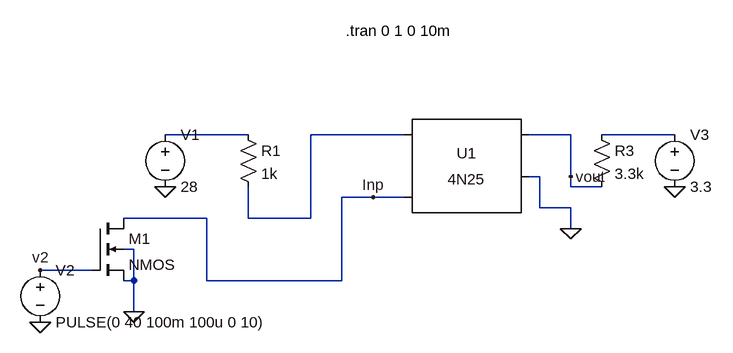
[diagram p0: schematic Optocoupler.asc]
Optocoupler.asc, the LTspice schematic file:
Version 4
SHEET 1 880 680
WIRE -128 112 -256 112
WIRE 112 112 -32 112
WIRE 368 112 304 112
WIRE 528 112 416 112
WIRE 320 176 304 176
WIRE 368 176 368 112
WIRE 368 192 368 176
WIRE 416 192 368 192
WIRE 64 208 16 208
WIRE 112 208 64 208
WIRE 320 224 320 176
WIRE 368 224 320 224
WIRE -192 240 -320 240
WIRE -128 240 -128 192
WIRE -32 240 -32 112
WIRE -32 240 -128 240
WIRE 368 256 368 224
WIRE -304 288 -320 288
WIRE -368 320 -448 320
WIRE -304 336 -304 288
WIRE -304 336 -320 336
WIRE -192 336 -192 240
WIRE 16 336 16 208
WIRE 16 336 -192 336
WIRE -304 384 -304 336
FLAG 368 256 0
FLAG -304 384 0
FLAG -448 400 0
FLAG -256 192 0
FLAG 528 192 0
FLAG 368 176 vout
FLAG 64 208 Inp
FLAG -448 320 v2
SYMBOL Optos\\4N25 208 176 R0
SYMATTR InstName U1
SYMBOL res -144 96 R0
SYMATTR InstName R1
SYMATTR Value 1k
SYMBOL res 400 96 R0
SYMATTR InstName R3
SYMATTR Value 3.3k
SYMBOL voltage -256 96 R0
SYMATTR InstName V1
SYMATTR Value 28
SYMBOL nmos4 -368 240 R0
SYMATTR InstName M1
SYMBOL voltage -448 304 R0
WINDOW 123 0 0 Left 0
WINDOW 39 0 0 Left 0
SYMATTR InstName V2
SYMATTR Value PULSE(0 40 100m 100u 0 10)
SYMBOL voltage 528 96 R0
SYMATTR InstName V3
SYMATTR Value 3.3
TEXT 22 -48 Left 2 !.tran 0 1 0 10m

The netlist it stands for:
* Optocoupler.asc
XU1 N002 Inp vout 0 NC_01 4N25
R1 N001 N002 1k
R3 N003 vout 3.3k
V1 N001 0 28
M1 Inp v2 0 0 NMOS
V2 v2 0 PULSE(0 40 100m 100u 0 10)
V3 N003 0 3.3
.model NMOS NMOS
.model PMOS PMOS
.lib standard.mos
.tran 0 1 0 10m
.lib 4N25.sub
.backanno
.end

* Results of the author's LTspice run, read from the files saved beside the schematic
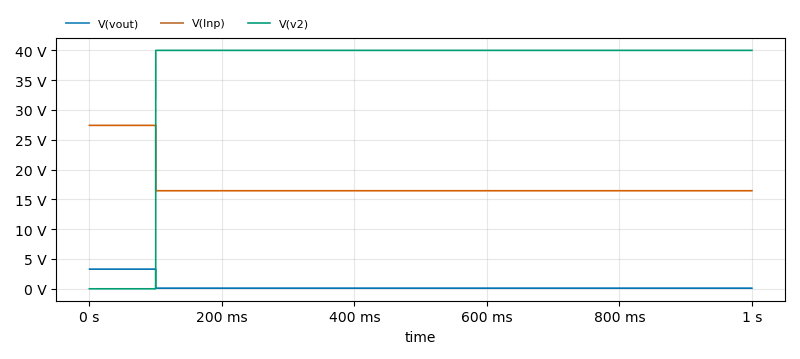
[diagram p1: Transient Analysis of Optocoupler.asc, plotted from the saved traces]
* Transient Analysis, 1 run:
*   V(vout): min 109 mV, max 3.3 V, average 428.2 mV, rms 1.049 V, last 109 mV
*   V(Inp): min 16.45 V, max 27.42 V, average 17.55 V, rms 17.85 V, last 16.45 V
*   V(v2): min 0 V, max 40 V, average 36 V, rms 37.95 V, last 40 V